# EAGLE schematic wk3-practice (EAGLE 9.5.0)
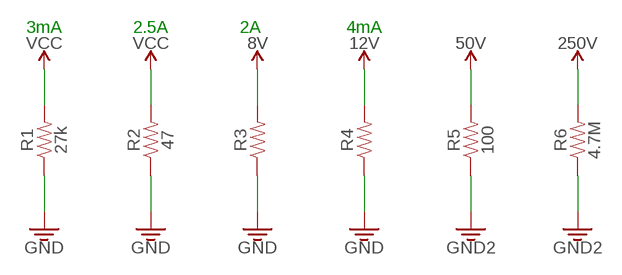
[diagram p0: schematic, sheet 1]

## Parts
R1  27k  RESISTORAXIAL-0.3  [AXIAL-0.3]
R2  47  RESISTORAXIAL-0.3  [AXIAL-0.3]
R3  RESISTORAXIAL-0.3  [AXIAL-0.3]
R4  RESISTORAXIAL-0.3  [AXIAL-0.3]
R5  100  RESISTORAXIAL-0.3  [AXIAL-0.3]
R6  4.7M  RESISTORAXIAL-0.3  [AXIAL-0.3]

## Nets
3.3V: R1.P$1 R2.P$1 R3.P$1 R4.P$1 R5.P$1 R6.P$1 ; supply symbol labelled GND, GND2
VCC: R1.P$2 R2.P$2 R3.P$2 R4.P$2 R5.P$2 R6.P$2 ; supply symbol labelled 8V, 12V, 50V, 250V

## Notes on the sheet
- 3mA | 2.5A | 2A | 4mA

## Library data of the parts
R1-R6 = SparkFun-Resistors:RESISTOR: Generic Resistor Package